# EAGLE design k1fm-pico-balloon-v1.2 (EAGLE 9.2.2)
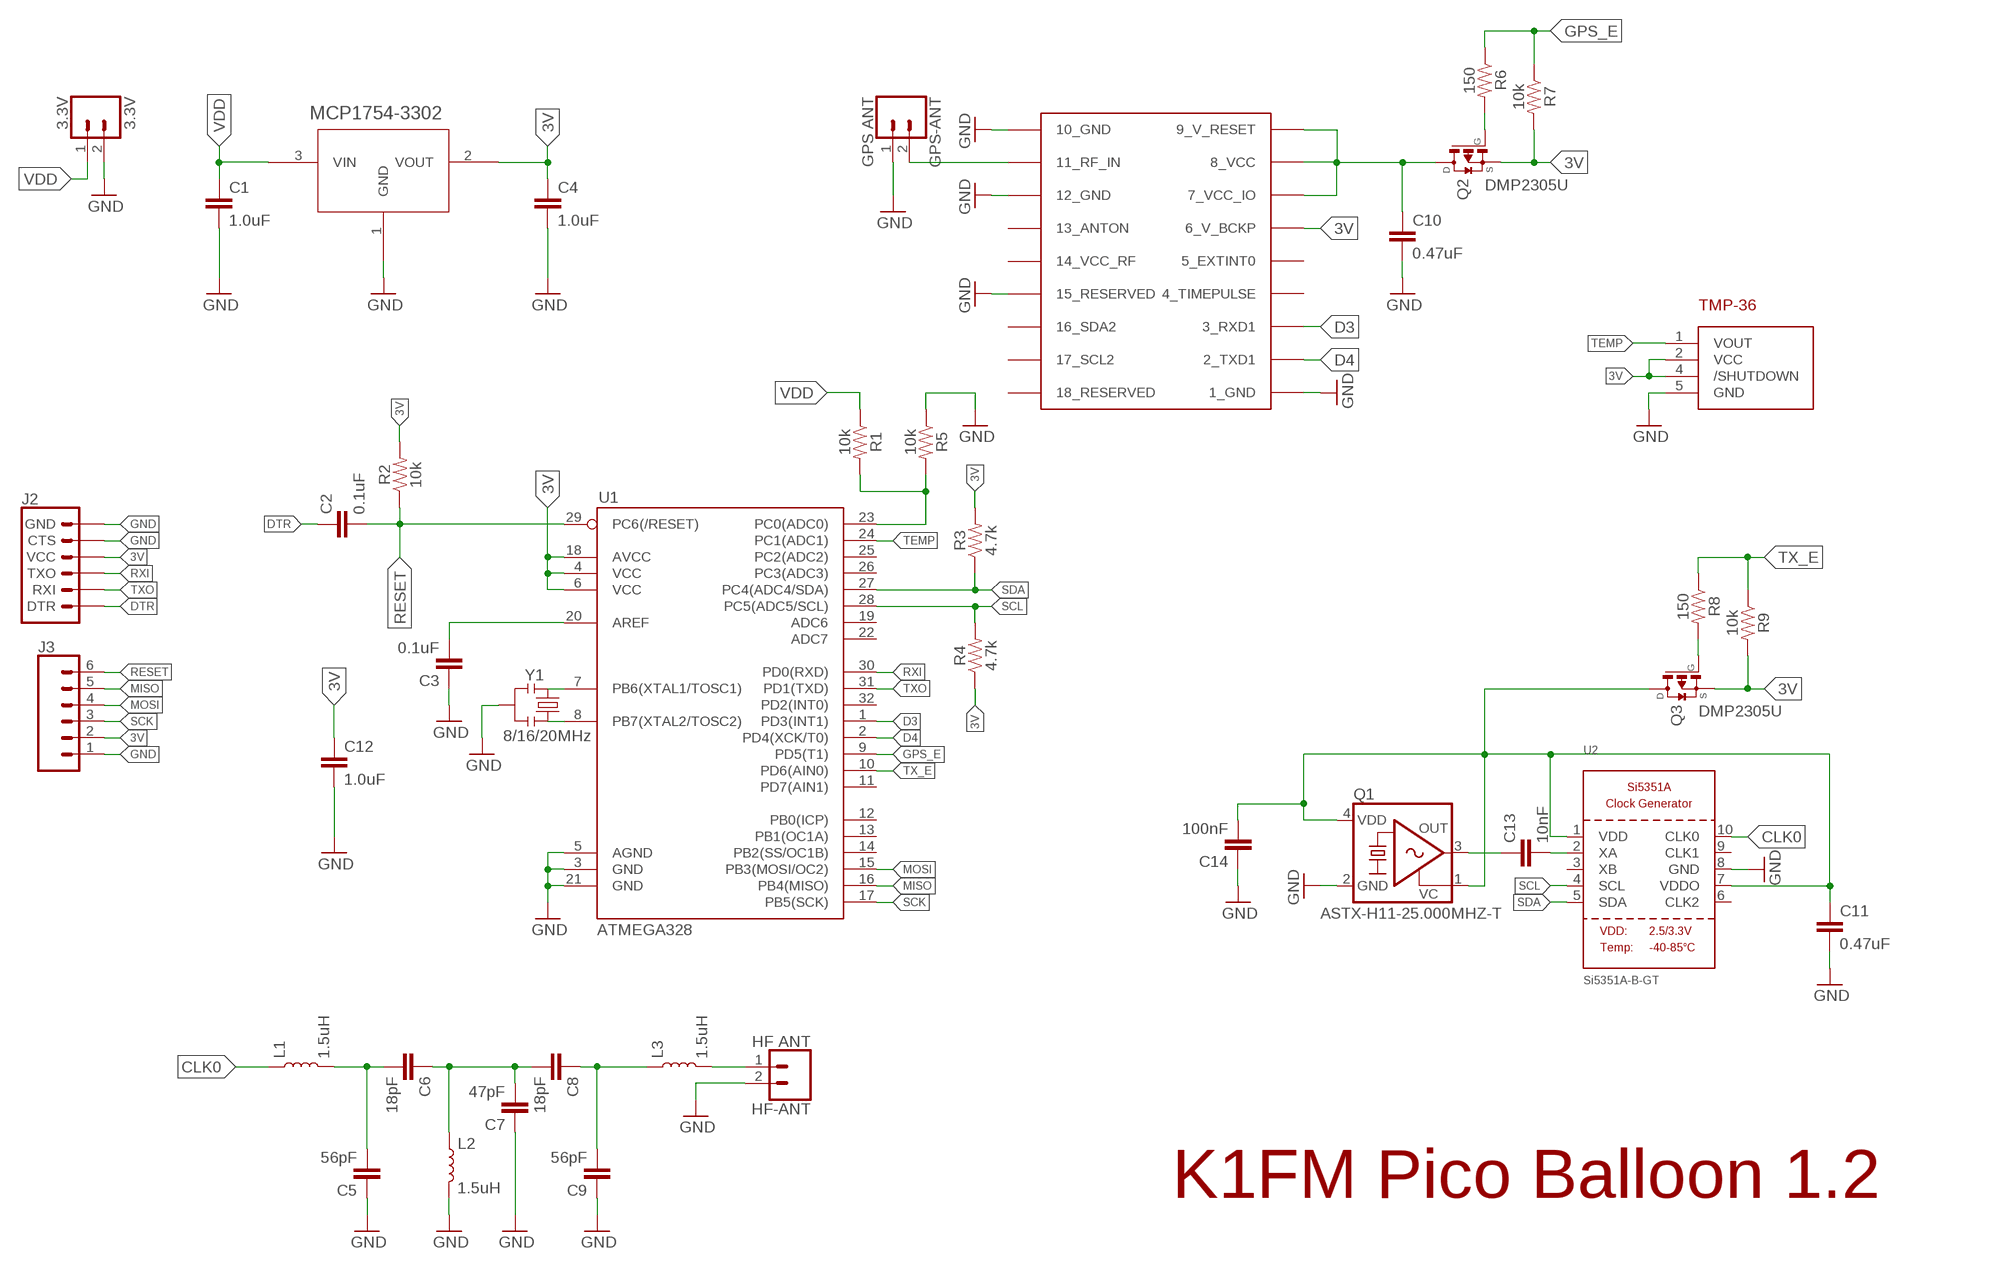
[diagram p0: schematic, sheet 1]

## Parts
3.3V  3.3V  CONN_02  [1X02]
C1  1.0uF  1.0UF-0603-16V-10%  [0603]
C2  0.1uF  0.1UF-0603-25V-5%  [0603]
C3  0.1uF  0.1UF-0603-25V-5%  [0603]
C4  1.0uF  1.0UF-0603-16V-10%  [0603]
C5  56pF  0.1UF-0603-25V-5%  [0603]
C6  18pF  0.1UF-0603-25V-5%  [0603]
C7  47pF  0.1UF-0603-25V-5%  [0603]
C8  18pF  0.1UF-0603-25V-5%  [0603]
C9  56pF  0.1UF-0603-25V-5%  [0603]
C10  0.47uF  0.1UF-0603-25V-5%  [0603]
C11  0.47uF  0.1UF-0603-25V-5%  [0603]
C12  1.0uF  1.0UF-0603-16V-10%  [0603]
C13  10nF  10NF-0603-50V-10%  [0603]
C14  100nF  10NF-0603-50V-10%  [0603]
GPS1  UBLOX_MAX  [UBLOX_MAX]
GPS-ANT  GPS ANT  CONN_02  [1X02]
HF-ANT  HF ANT  CONN_02  [1X02]
J2  6_PIN_SERIAL_TARGET  [1X06]
J3  CONN_06SILK_FEMALE_PTH  [1X06]
L1  1.5uH  INDUCTOR-0603-33NH  [0603]
L2  1.5uH  INDUCTOR-0603-33NH  [0603]
L3  1.5uH  INDUCTOR-0603-33NH  [0603]
Q1  ASTX-H11-25.000MHZ-T  KXO-VCXO-SINE-84  [3.2X2.5_KXO-84]
Q2  DMP2305U  [SOT23]
Q3  DMP2305U  [SOT23]
R1  10k  10KOHM-0603-1/10W-1%  [0603]
R2  10k  10KOHM-0603-1/10W-1%  [0603]
R3  4.7k  4.7KOHM-0603-1/10W-1%  [0603]
R4  4.7k  4.7KOHM-0603-1/10W-1%  [0603]
R5  10k  10KOHM-0603-1/10W-1%  [0603]
R6  150  10KOHM-0603-1/10W-1%  [0603]
R7  10k  10KOHM-0603-1/10W-1%  [0603]
R8  150  10KOHM-0603-1/10W-1%  [0603]
R9  10k  10KOHM-0603-1/10W-1%  [0603]
U1  ATMEGA328  ATMEGA168  [TQFP32-08]
U2  Si5351A-B-GT  SI5351A  [MSOP10]
U3  MCP1754X-XXXXX/C  [SOT-23A_MC]
U4  TMP36  [SOT-23]
Y1  8/16/20MHz  RESONATOR1:1  [RESONATOR-SMD-1:1]

## Nets
3V: C4.1 C12.1 GPS1.6_V_BCKP J2.4(VCC) J3.2 Q2.2(S) Q3.2(S) R2.2 R3.2 R4.1 R7.2 R9.2 U1.4(VCC) U1.6(VCC) U1.18(AVCC) U3.2(VOUT) U4.2(VCC) U4.4(/SHUTDOWN)
ANT: HF-ANT.1 L3.2
AREF: C3.2 U1.20(AREF)
CLK0: L1.1 U2.10(CLK0)
D3: GPS1.3_RXD1 U1.1(PD3(INT1))
D4: GPS1.2_TXD1 U1.2(PD4(XCK/T0))
DTR: C2.1 J2.1(DTR)
GND: 3.3V.2 C1.2 C3.1 C4.2 C5.1 C7.1 C9.1 C10.2 C11.2 C12.2 C14.1 GPS1.1_GND GPS1.10_GND GPS1.12_GND GPS1.15_RESERVED GPS-ANT.1 HF-ANT.2 J2.5(CTS) J2.6(GND) J3.1 L2.2 Q1.2(GND) R5.1 U1.3(GND) U1.5(AGND) U1.21(GND) U2.8(GND) U3.1(GND) U4.5(GND) Y1.2
GPS_E: R6.1 R7.1 U1.9(PD5(T1))
MISO: J3.5 U1.16(PB4(MISO))
MOSI: J3.4 U1.15(PB3(MOSI/OC2))
N$1: C13.1 Q1.3(OUT)
N$2: C13.2 U2.2(XA)
N$4: R1.2 R5.2 U1.23(PC0(ADC0))
N$5: Q2.1(G) R6.2
N$6: GPS1.11_RF_IN GPS-ANT.2
N$7: Q3.1(G) R8.2
N$8: C10.1 GPS1.7_VCC_IO GPS1.8_VCC GPS1.9_V_RESET Q2.3(D)
N$9: C6.1 C7.2 C8.2 L2.1
N$12: C5.2 C6.2 L1.2
N$13: C8.1 C9.2 L3.1
N$15: C11.1 C14.2 Q1.1(VC) Q1.4(VDD) Q3.3(D) U2.1(VDD) U2.7(VDDO)
N$28: U1.8(PB7(XTAL2/TOSC2)) Y1.3
N$29: U1.7(PB6(XTAL1/TOSC1)) Y1.1
RESET: C2.2 J3.6 R2.1 U1.29(PC6(/RESET))
RXI: J2.3(TXO) U1.30(PD0(RXD))
SCK: J3.3 U1.17(PB5(SCK))
SCL: R4.2 U1.28(PC5(ADC5/SCL)) U2.4(SCL)
SDA: R3.1 U1.27(PC4(ADC4/SDA)) U2.5(SDA)
TEMP: U1.24(PC1(ADC1)) U4.1(VOUT)
TX_E: R8.1 R9.1 U1.10(PD6(AIN0))
TXO: J2.2(RXI) U1.31(PD1(TXD))
VDD: 3.3V.1 C1.1 R1.1 U3.3(VIN)
Unconnected: GPS1.4_TIMEPULSE GPS1.5_EXTINT0 GPS1.13_ANTON GPS1.14_VCC_RF GPS1.16_SDA2 GPS1.17_SCL2 GPS1.18_RESERVED U1.11(PD7(AIN1)) U1.12(PB0(ICP)) U1.13(PB1(OC1A)) U1.14(PB2(SS/OC1B)) U1.19(ADC6) U1.22(ADC7) U1.25(PC2(ADC2)) U1.26(PC3(ADC3)) U1.32(PD2(INT0)) U2.3(XB) U2.6(CLK2) U2.9(CLK1)

## Notes on the sheet
- K1FM Pico Balloon 1.2

## Library data of the parts
3.3V GPS-ANT HF-ANT = SparkFun-Connectors:CONN_02: Multi connection point. Often used as Generic Header-pin footprint for 0.1 inch spaced/style header connections On any of the 0.1 inch spaced packages, you can populate with these: Break Away Headers - Straight <https://www.sparkfun.com/products/116> (PRT-00116) Break Away Male Headers - Right Angle <https://www.sparkfun.com/products/553> (PRT-00553) Female Headers <https://www.sparkfun.com/products/115> (PRT-00115) Break Away Headers - Machine Pin <https://www.sparkfun.com/products/117> (PRT-00117) Break Away Female Headers - Swiss Machine Pin <https://www.sparkfun.com/products/743> (PRT-00743) For SCREWTERMINALS and SPRING TERMINALS visit here: Screw Terimnals on SparkFun.com <https://www.sparkfun.com/search/results?term=Screw+Terminals> (5mm/3.5mm/2.54mm spacing) This device is also useful as a general connection point to wire up your design to another part of your project. Our various solder wires solder well into these plated through hole pads. Hook-Up Wire - Assortment (Stranded, 22 AWG) <https://www.sparkfun.com/products/11375> (PRT-11375) Hook-Up Wire - Assortment (Solid Core, 22 AWG) <https://www.sparkfun.com/products/11367> (PRT-11367) View the entire wire category on our website here <https://www.sparkfun.com/categories/141> Special notes: Molex polarized connector foot print use with: PRT-08233 with associated crimp pins and housings. 2.54_SCREWTERM for use with PRT-10571. 3.5mm Screw Terminal footprints for PRT-08084 5mm Screw Terminal footprints for use with PRT-08432
C1 C4 C12 = SparkFun-Capacitors:1.0UF: 1µF ceramic capacitors A capacitor is a passive two-terminal electrical component used to store electrical energy temporarily in an electric field.; PROD_ID: CAP-00868
C2 C3 = SparkFun-Capacitors:0.1UF: 0.1µF ceramic capacitors A capacitor is a passive two-terminal electrical component used to store electrical energy temporarily in an electric field.; PROD_ID: CAP-08604
C5-C11 = SparkFun-Capacitors:0.1UF: 0.1µF ceramic capacitors A capacitor is a passive two-terminal electrical component used to store electrical energy temporarily in an electric field.; PROD_ID: CAP-08604; VALUE: 0.1uF
C13 = SparkFun-Capacitors:10NF: 0.01uF/10nF/10,000pF ceramic capacitors A capacitor is a passive two-terminal electrical component used to store electrical energy temporarily in an electric field. CAP-09321; PROD_ID: CAP-00867
C14 = SparkFun-Capacitors:10NF: 0.01uF/10nF/10,000pF ceramic capacitors A capacitor is a passive two-terminal electrical component used to store electrical energy temporarily in an electric field. CAP-09321; PROD_ID: CAP-00867; VALUE: 10nF
GPS1 = Ava:UBLOX_MAX: UBLOX MAX
J2 = SparkFun-Connectors:6_PIN_SERIAL_TARGET: 6-pin header connection for use with the "FTDI BASIC" pinout - TARGET SIDE. Also known as "Arduino Serial Program Header". It is used to mate with our FTDI Basic serial programmers using the Arduino IDE. Note, this device has "TARGET" in the name. It is intended to be used on a design that contains a target micro-controller that you wish to program. The "sister" device, named "CABLE" is inteneded to be used on a design that usually lives on the end of your USB cable and prvides the converter chip (FTDI232 or FTDI231x) to commnicate serial RX/TX. You can populate with some of these: Break Away Headers - Straight <https://www.sparkfun.com/products/116> (PRT-00116) For reference (or to suit your programming needs) check out these designs: SparkFun FTDI Basic Breakout - 5V <https://www.sparkfun.com/products/9716> (DEV-09716) SparkFun FTDI Basic Breakout - 3.3V <https://www.sparkfun.com/products/9873> (DEV-09873) SparkFun FTDI SmartBasic <https://www.sparkfun.com/products/12935> (DEV-12935) SparkFun Beefy 3 - FTDI Basic Breakout <https://www.sparkfun.com/products/13746> (DEV-13746)
J3 = SparkFun-Connectors:CONN_06: Multi connection point. Often used as Generic Header-pin footprint for 0.1 inch spaced/style header connections On any of the 0.1 inch spaced packages, you can populate with these: Break Away Headers - Straight <https://www.sparkfun.com/products/116> (PRT-00116) Break Away Male Headers - Right Angle <https://www.sparkfun.com/products/553> (PRT-00553) Female Headers <https://www.sparkfun.com/products/115> (PRT-00115) Break Away Headers - Machine Pin <https://www.sparkfun.com/products/117> (PRT-00117) Break Away Female Headers - Swiss Machine Pin <https://www.sparkfun.com/products/743> (PRT-00743) Arduino Stackable Header - 6 Pin <https://www.sparkfun.com/products/9280> (PRT-09280) For SCREWTERMINALS and SPRING TERMINALS visit here: Screw Terimnals on SparkFun.com <https://www.sparkfun.com/search/results?term=Screw+Terminals> (5mm/3.5mm/2.54mm spacing) This device is also useful as a general connection point to wire up your design to another part of your project. Our various solder wires solder well into these plated through hole pads. Hook-Up Wire - Assortment (Stranded, 22 AWG) <https://www.sparkfun.com/products/11375> (PRT-11375) Hook-Up Wire - Assortment (Solid Core, 22 AWG) <https://www.sparkfun.com/products/11367> (PRT-11367) View the entire wire category on our website here <https://www.sparkfun.com/categories/141>; PROD_ID: CONN-08437
L1-L3 = SparkFun-Coils:INDUCTOR: Inductors Resist changes in electrical current. Basically a coil of wire. SparkFun Products: SparkFun Load Cell Amplifier - HX711 <https://www.sparkfun.com/products/13879> IOIO-OTG - V2.2 <https://www.sparkfun.com/products/13613>; PROD_ID: NDUC-07874; VALUE: 33nH/±5%/500mA
Q1 = crystal-geyer_V1_0:KXO-VCXO-SINE: VCXO : Sinewave - Serie Model Size l/w/h [mm] Frequency Range Frequency Stability Temp. Range [°C] Output AECQ 200 availabel Datasheet KXO-81 KXO-86 KXO-84 KXO-83 KXO-82 2.0/1.6/0.7 2.5/2.0/0.7 3.2/2.5/1.0 5.0/3.2/1.5 7.0/5.0/2.0 13,0 ~ 40,0 MHz 13,0 ~ 40,0 MHz 10,0 ~ 26,0 MHz 12,0 ~ 26,0 MHz 12,6 ~ 20,0 MHz ±10 … ±50ppm ±10 … ±50ppm ±10 … ±50ppm ±10 … ±50ppm ±10 … ±50ppm (*) -30°C …+75°C (*) -30°C …+75°C (*) -40°C …+85°C (*) -40°C …+85°C (*) -30°C …+80°C Sinewave Sinewave Sinewave Sinewave Sinewave - - - - - KXO-81.pdf <http://www.geyer-electronic.de/uploads/tx_userartikelfrequenz/GEYER-KXO-81-VCXO-sinewave.pdf> KXO-86.pdf <http://www.geyer-electronic.de/uploads/tx_userartikelfrequenz/GEYER-KXO-86-VCXO-sinewave.pdf> KXO-84.pdf <http://www.geyer-electronic.de/uploads/tx_userartikelfrequenz/GEYER-KXO-84-VCXO-sinewave.pdf> KXO-83.pdf <http://www.geyer-electronic.de/uploads/tx_userartikelfrequenz/GEYER-KXO-83-VCXO-sinewave.pdf> KXO-82.pdf <http://www.geyer-electronic.de/uploads/tx_userartikelfrequenz/GEYER-KXO-82-VCXO-sinewave.pdf> <http://www.geyer-electronic.de/fileadmin/template/img/logo-geyer-electronic.png> Details see: http://www.geyer-electronic.de/Frequenz-Produkte.9.0.html Created 2016-06-07, Hans Locher 2016 (C) Geyer Quartz Technology KXO81,KXO86,KXO84,KXO83,KXO82,2,0x1,6;2.0x1.6;2,5x2,0;2.5x2.0;3,2x2,5;3.2x2.5;5,0x3,2;5.0x3.2;7,0x5,0;7.0x5.0;2016;2520;3225;5032;7050
Q2 Q3 = transistor-fet:DMP2305U: P-Channel Enhancement MOSFET
R1 R2 R5 R7 R9 = SparkFun-Resistors:10KOHM: 10kΩ resistor A resistor is a passive two-terminal electrical component that implements electrical resistance as a circuit element. Resistors act to reduce current flow, and, at the same time, act to lower voltage levels within circuits. - Wikipedia; PROD_ID: RES-00824
R3 R4 = SparkFun-Resistors:4.7KOHM: 4.7kΩ resistor A resistor is a passive two-terminal electrical component that implements electrical resistance as a circuit element. Resistors act to reduce current flow, and, at the same time, act to lower voltage levels within circuits. - Wikipedia; PROD_ID: RES-07857
R6 R8 = SparkFun-Resistors:10KOHM: 10kΩ resistor A resistor is a passive two-terminal electrical component that implements electrical resistance as a circuit element. Resistors act to reduce current flow, and, at the same time, act to lower voltage levels within circuits. - Wikipedia; PROD_ID: RES-00824; VALUE: 10k
U1 = SparkFun:ATMEGA168
U2 = microbuilder:SI5351A: Si5351A 8kHz-160MHz I2C Clock Generator VDD: 2.5V or 3.3V Input Range: 25MHz or 27MHz XTAL User selectable internal input load capacitors: 6, 8 or 10 pF Output Impedance: 85 Ohm Output Load Capacitance: 5-15pF Operating Temperature: -40°C - 85°C Operating Current (3 outputs): 35mA Output buffer voltage (VDDO): 1.8, 2.5 or 3.3V Note: If VDDO is not used it should be connected to VDD. Unused clock out pins should be left floating.
U3 = MCP1754:MCP1754X-XXXXX/C
U4 = TMP36:TMP36
Y1 = Testing:RESONATOR: Resonator Small SMD resonator. This is the itty bitty 10/20MHz resonators with built in caps. CSTCE10M0G55 and CSTCE20M0V53. Footprint for SMD has been used in SFE production for years, and does work okay. 1:1 is an attempt to get larger fillets on the sides so it will be easier to inspect these solders in our AOI machine. The pads have been minimized to match the actual metal under the resonator. To see this relation, it includes an image import of the bottom side of the component. Imported to scale on layer 200.

## Net classes
1 vcc: width 0.254 mm

## Board
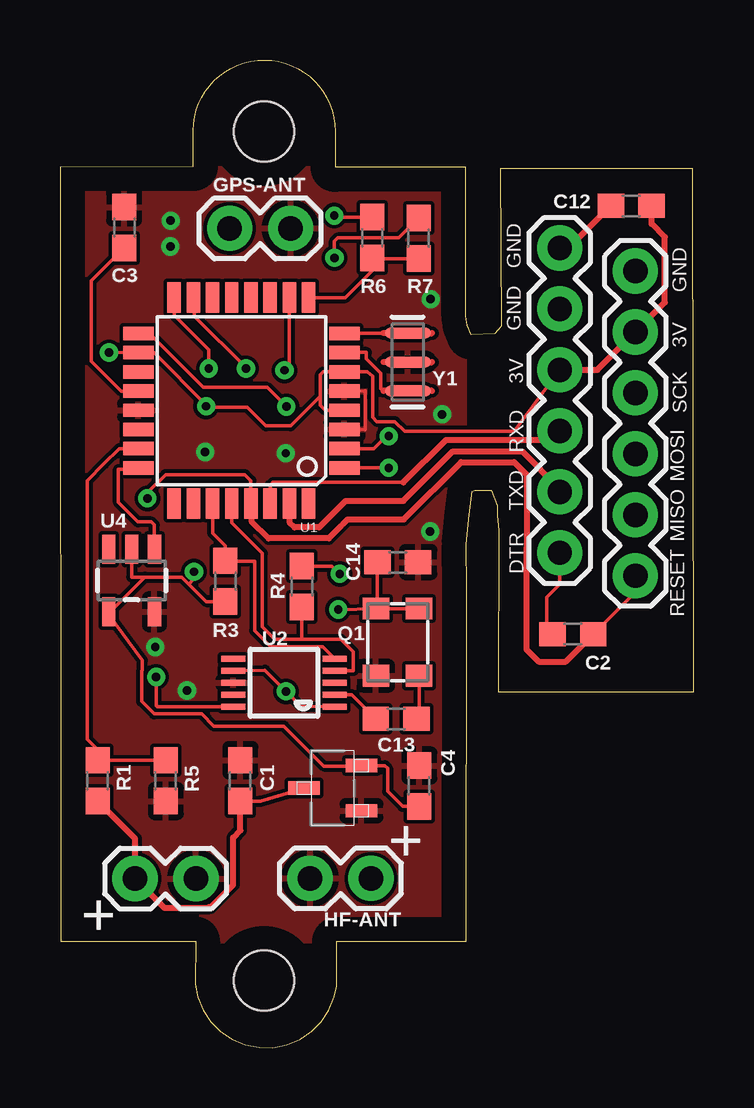
[diagram p1: board, top side]
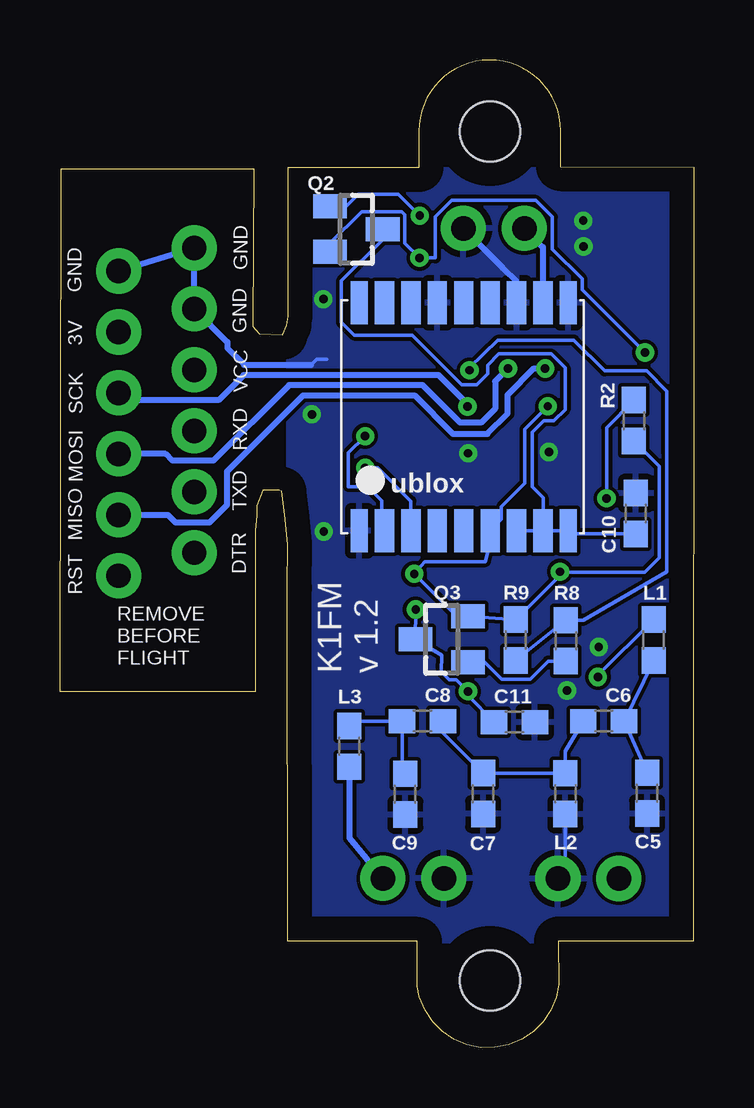
[diagram p2: board, bottom side, seen from below]

Size 26.41 x 41.15 mm. Coordinates in mm from the lower left corner, seen from the top.
Outline: 0.02,4.43 5.65,4.44 5.64,2.62 5.75,2.1 5.97,1.56 6.29,1.08 6.71,0.66 7.18,0.34 7.72,0.12 8.3,0 8.87,0 9.46,0.12 10,0.34 10.49,0.67 10.88,1.06 11.21,1.55 11.44,2.11 11.53,2.56 11.53,4.42 16.93,4.43 16.94,19.15 16.93,20.95 17.03,22 17.08,22.37 17.17,23.17 17.29,23.22 17.96,23.23 18.22,22.58 18.22,22.46 18.22,22.18 18.28,21.54 18.29,21.52 18.27,14.81 26.41,14.82 26.37,36.62 18.35,36.61 18.38,30.05 18.12,29.73 17.13,29.7 16.96,30.1 16.91,30.48 16.91,36.67 11.46,36.67 11.46,38.17 arc180 5.55,38.21 5.55,36.71 0,36.67 0.02,4.43
Copper layers (1*16): Top 0.035mm / dielectric 0.15mm / Bottom 0.035mm
Design rules "default": minimum track width 6mil, minimum drill 0.35mm, track to track 6mil, track to pad 6mil, pad to pad 6mil, via to via 6mil, smd to smd 6mil, copper to edge 40mil, drill to drill 6mil, minimum pad ring 10mil, minimum via ring 8mil, stop-mask expansion 4mil, vias tented up to drill 0mil, thermal gap 10mil
Holes 2.5 mm at 8.5,38.17 8.5,2.79

### Footprints (pad centres in the part's own frame; a part is rotated, then mirrored left to right if it is on the bottom)
1X02 = drill 1.016 pad 1.88: 1 0,0; 2 2.54,0
0603 = smd 1.1 x 1: 1 -0.85,0; 2 0.85,0
UBLOX_MAX = smd 1.8 x 0.7: 1_GND 4.95,-4.4; 9_V_RESET 4.95,4.3; 10_GND -4.55,4.3; 18_RESERVED -4.55,-4.4 | smd 1.8 x 0.8: 2_TXD1 4.95,-3.35; 3_RXD1 4.95,-2.25; 4_TIMEPULSE 4.95,-1.15; 5_EXTINT0 4.95,-0.05; 6_V_BCKP 4.95,1.05; 7_VCC_IO 4.95,2.15; 8_VCC 4.95,3.25; 11_RF_IN -4.55,3.25; 12_GND -4.55,2.15; 13_ANTON -4.55,1.05; 14_VCC_RF -4.55,-0.05; 15_RESERVED -4.55,-1.15; 16_SDA2 -4.55,-2.25; 17_SCL2 -4.55,-3.35
1X06 = drill 1.016 pad 1.88: 1 0,0; 2 2.54,0; 3 5.08,0; 4 7.62,0; 5 10.16,0; 6 12.7,0
3.2X2.5_KXO-84 = smd 0.9 x 1.1: 1 -1.4,-0.9; 2 1.4,-0.9; 3 1.4,0.9; 4 -1.4,0.9
SOT23 = smd 1 x 1.4: 1 -0.95,-1.1; 2 0.95,-1.1; 3 0,1.1
TQFP32-08 = smd 1.27 x 0.559: 1 -4.293,2.8; 2 -4.293,2; 3 -4.293,1.2; 4 -4.293,0.4; 5 -4.293,-0.4; 6 -4.293,-1.2; 7 -4.293,-2; 8 -4.293,-2.8; 17 4.293,-2.8; 18 4.293,-2; 19 4.293,-1.2; 20 4.293,-0.4; 21 4.293,0.4; 22 4.293,1.2; 23 4.293,2; 24 4.293,2.8 | smd 0.559 x 1.27: 9 -2.8,-4.293; 10 -2,-4.293; 11 -1.2,-4.293; 12 -0.4,-4.293; 13 0.4,-4.293; 14 1.2,-4.293; 15 2,-4.293; 16 2.8,-4.293; 25 2.8,4.293; 26 2,4.293; 27 1.2,4.293; 28 0.4,4.293; 29 -0.4,4.293; 30 -1.2,4.293; 31 -2,4.293; 32 -2.8,4.293
MSOP10 = smd 0.25 x 1: 1 -1,-2.113; 2 -0.5,-2.113; 3 0,-2.113; 4 0.5,-2.113; 5 1,-2.113; 6 1,2.113; 7 0.5,2.113; 8 0,2.113; 9 -0.5,2.113; 10 -1,2.113
SOT-23A_MC = smd 0.559 x 1.321: 1 -0.94,-1.194; 2 0.94,-1.194; 3 0,1.194
SOT-23 = smd 0.55 x 1.2: 1 -0.95,-1.3; 2 0,-1.3; 3 0.95,-1.3; 4 0.95,1.3; 5 -0.95,1.3
RESONATOR-SMD-1:1 = smd 0.45 x 1.905: 1 -1.2,0; 2 0,0; 3 1.2,0

### Placement (x,y rotation side)
3.3V  3.13,7.04 0 top
C1  7.51,11.12 90 top
C2  21.37,17.22 0 top
C3  2.67,34.17 270 top
C4  14.97,10.9 90 top
C5  1.95,10.6 90 bottom
C6  3.76,13.59 0 bottom
C7  8.78,10.58 90 bottom
C8  11.31,13.59 0 bottom
C9  12.03,10.56 90 bottom
C10  2.42,22.25 90 bottom
C11  7.48,13.56 0 bottom
C12  23.8,35.07 180 top
C13  14,13.7 180 top
C14  14.07,20.22 180 top
GPS1  9.54,26.48 270 bottom
GPS-ANT  9.61,34.13 180 top
HF-ANT  12.96,7.05 180 top
J2  20.82,20.61 90 top
J3  23.97,32.35 270 top
L1  1.68,16.98 270 bottom
L2  5.36,10.58 270 bottom
L3  14.37,12.55 270 bottom
Q1  14.06,16.89 270 top
Q2  14.07,34.1 270 bottom
Q3  10.51,17.01 90 bottom
R1  1.56,11.12 90 top
R2  2.5,26.12 270 bottom
R3  6.89,19.43 270 top
R4  10.08,19.21 270 top
R5  4.41,11.12 90 top
R6  13.02,33.75 90 top
R7  14.95,33.72 90 top
R8  5.34,16.95 270 bottom
R9  7.42,16.98 90 bottom
U1  7.56,26.95 180 top
U2  9.33,15.2 90 top
U3  11.37,10.81 90 top
U4  2.99,19.46 180 top
Y1  14.49,28.56 90 top

### Tracks (layer width: path | path; a pad name or v marks a point on that pad's centre or on a via)
3V  (via drill 0.35)
  Top 0.152: 10.85,27.14 10.85,26.75 11.05,26.55 U1.4 | 10.85,27.14 10.85,28.04 10.96,28.15 U1.6 12.8,28.15 13.04,27.97 13.04,26.25 13.21,26.08 13.95,26.08 14.36,25.67 18.92,25.67 J2.4 | 10.85,27.14 9.61,25.91 8.58,25.91 7.81,26.67 6.13,26.67 v6.09,26.72 6.12,26.75 3.92,28.95 U1.18 v2.04,28.96 | 3.54,19.6 2.1,18.16 U4.4 2.04,18.03 3.44,16.13 3.44,15.73 3.4,15.69 3.4,14.42 3.92,13.9 5.9,13.9 6.41,13.39 9.32,13.39 arc90 9.32,13.39 10.99,11.72 12.54,11.72 U3.2 13.53,11.75 13.65,11.63 13.65,10.68 14.28,10.05 C4.1 | U4.2 | U4.2 2.99,19.6 3.54,19.6 | 3.54,19.6 5.07,19.6 5.36,19.31 | R3.2 6.08,18.58 5.36,19.31 | v5.58,19.83 5.58,19.53 5.36,19.31 | R7.2 14.11,33.73 11.56,33.73 11.44,33.6 v11.44,32.9 | R4.1 11.33,20.06 v11.66,19.73
  Top 0.254: J2.4 22.39,28.23 J3.2 25.2,31.05 25.2,33.77 24.65,34.32 C12.1
  Bottom 0.152: v6.09,26.72 7.04,25.77 7.04,23.51 8.02,22.53 8.02,22.01 GPS1.6_V_BCKP 8.38,21.42 8.69,20.25 11.21,20.25 v11.66,19.73 9.88,17.96 Q3.2 R9.2 5.58,19.67 5.58,19.81 | v2.04,28.96 4.66,31.58 4.66,32.03 5.9,33.27 5.9,34.61 6.58,35.3 10.09,35.3 10.78,34.61 10.78,32.9 v11.44,32.9 12.04,33.51 12.04,34.69 12.17,34.83 13.85,34.83 15.17,33.5 Q2.2 | 5.58,19.81 v5.58,19.83 | R2.2 1.45,24.22 1.45,20.4 2.04,19.81 5.58,19.81
ANT
  Bottom 0.254: L3.2 14.35,11.68 14.35,8.72 HF-ANT.1
AREF
  Top 0.152: U1.20 2.54,27.35 1.3,28.59 1.3,31.95 C3.2
CLK0  (via drill 0.35)
  Top 0.152: U2.10 4.05,14.2 4,14.25 v4,15.44
  Bottom 0.152: v4,15.44 4,15.51 L1.1
D3  (via drill 0.35)
  Top 0.152: v13.7,24.15 U1.1
  Bottom 0.152: GPS1.3_RXD1 11.79,22.76 13.18,24.15 v13.7,24.15
D4  (via drill 0.35)
  Top 0.152: U1.2 13.08,24.95 13.6,25.47 v13.7,25.47
  Bottom 0.152: GPS1.2_TXD1 13,21.64 13,22.77 13.6,23.37 14.4,23.37 14.4,24.77 v13.7,25.47
DTR
  Top 0.152: J2.1 20.82,19.31 20.29,18.77 20.29,17.45 C2.1
GND  (via drill 0.35)
  Top 0.152: 13.83,28.56 Y1.2 13.71,28.59 | U1.5 12.72,27.36 12.72,25.74 U1.3
  Top 0.254: C12.2 21.2,33.31 J2.6
  Bottom 0.152: 15.3,28.67 15.71,28.67 15.95,28.44 | L2.2 5.36,7.35 3.3V.2
  Bottom 0.25: J2.5 19.44,29.39 19.44,29.14 18.74,28.44 15.95,28.44
  Bottom 0.254: GPS-ANT.1 7.97,32.49 7.97,32.47 7.39,31.9 GPS1.12_GND | J2.5 J2.6 J3.1
  other vias: 4.6,33.37 6.05,24.81 15.44,31.18 4.61,34.45 15.92,26.38 15.42,21.5 5.29,14.87 3.97,16.69 9.41,24.76
  pour Top: 0,36.65 16.89,36.65 16.89,36.65 16.89,4.43 16.93,4.47 16.93,4.41 0.04,4.41 0.02,4.43
  pour Bottom: -0.02,36.62 16.93,36.62 16.93,4.42 16.94,4.41 0.05,4.41 0,4.46
GPS_E
  Top 0.152: U1.9 11.89,31.25 13.02,32.37 R6.1 13.04,32.87 R7.1
MISO  (via drill 0.35)
  Top 0.152: v6.2,28.29 6.2,29.08 4.76,30.52 U1.16
  Bottom 0.254: J3.5 21.91,22.19 21.61,21.89 20.18,21.89 19.45,22.61 19.45,24 16.29,27.17 11.64,27.17 10.04,25.57 8.61,25.57 7.77,26.41 7.77,27.19 6.67,28.29 v6.2,28.29
MOSI  (via drill 0.35)
  Top 0.152: v7.75,28.29 7.75,28.32 5.6,30.47 5.6,31.2 U1.15
  Bottom 0.254: J3.4 22.02,24.73 21.73,24.45 20.02,24.45 16.87,27.6 11.31,27.6 9.74,26.03 8.86,26.03 8.28,26.61 8.28,27.76 v7.75,28.29
N$1
  Top 0.152: Q1.3 14.96,15.37 14.96,15.2 14.96,13.8 arc-90 C13.1
N$2
  Top 0.152: U2.2 12.15,14.7 C13.2
N$4
  Top 0.152: U1.23 2.47,24.95 1.83,24.32 1.83,24.31 1.13,23.61 1.13,12.84 1.56,12.41 R1.2 R5.2
N$5  (via drill 0.35)
  Top 0.152: v11.43,34.66 11.49,34.6 R6.2
  Bottom 0.152: Q2.1 14.49,35.05 13.98,35.56 12.33,35.56 v11.43,34.66
N$6
  Bottom 0.254: GPS-ANT.2 6.29,33.35 GPS1.11_RF_IN
N$7
  Bottom 0.152: R8.2 6.08,16.1 6.83,15.35 8.02,15.35 8.72,16.06 Q3.1
N$8
  Bottom 0.152: GPS1.7_VCC_IO GPS1.8_VCC | GPS1.8_VCC 5.3,21.53 | 5.3,21.53 GPS1.9_V_RESET | Q2.3 12.97,33.67 14.69,31.94 14.69,30.21 14.16,29.68 11.75,29.68 9.67,27.61 9.05,27.61 8.59,28.07 8.59,28.43 8.13,28.9 5.95,28.9 5.37,28.32 5.37,26.58 5.84,26.11 6.27,26.11 6.74,25.64 6.74,23.36 6.29,22.91 GPS1.8_VCC | C10.1 5.17,21.4 5.3,21.53
N$9
  Bottom 0.152: C6.1 5.36,12.34 L2.1 C7.2 10.46,13.11 C8.2
N$12
  Bottom 0.152: L1.2 1.7,16.08 C6.2 C5.2
N$13
  Bottom 0.152: C9.2 12.16,11.54 C8.1 14.18,13.59 L3.1
N$15  (via drill 0.35)
  Top 0.152: U2.7 8.54,15.72 9.24,15.01 v9.42,14.84 10.03,14.22 U2.1 | Q1.4 Q1.1 | Q1.1 v11.59,18.25 11.57,18.22 | Q1.1 13.22,18.35 C14.2
  Bottom 0.152: v11.59,18.25 Q3.3 10.52,16.34 10.53,15.66 10.21,15.33 9.91,15.33 v9.42,14.84 9.42,14.68 C11.1
N$28
  Top 0.152: U1.8 Y1.3
N$29
  Top 0.152: Y1.1 13.46,27.35 13.36,27.45 13.36,28.1 12.76,28.69 12.76,28.96 U1.7
RESET  (via drill 0.35)
  Top 0.152: C2.2 23.97,18.97 J3.6 | 7.98,22.64 U1.29 7.96,23.61 7.7,23.87 4.4,23.87 3.64,23.11 v3.64,22.88 | 11.79,21.81 11.71,21.73 | 19.44,20.81 19.44,20.8
  Top 0.254: C2.2 21.08,16.08 19.94,16.08 19.44,16.58 19.44,20.8 | 7.98,22.64 7.98,21.93 8.7,21.22 11.2,21.22 11.71,21.73 | 11.79,21.81 11.98,22.01 14.33,22.01 16.71,24.39 18.92,24.39 19.44,23.86 19.44,20.81
  Bottom 0.152: R2.1 3.64,25.83 v3.64,22.88
RXI
  Top 0.152: U1.30 8.76,23.43 8.87,23.55 14.31,23.55
  Top 0.254: J2.3 20.44,25.31 16.07,25.31 14.31,23.55
SCK  (via drill 0.35)
  Top 0.152: U1.17 3.72,29.75 5.33,28.15 5.97,27.51 8.63,27.51 v9.43,26.71
  Bottom 0.152: v9.43,26.71 9.38,26.76
  Bottom 0.25: 9.38,26.76 10.64,28.01 18.76,28.01 19.8,26.97 23.67,26.97 J3.3
SCL
  Top 0.152: U2.4 12.21,15.7 12.22,15.72 12.22,16.49 11.7,17.02 10.11,17.02 | 10.11,17.02 8.94,17.02 8.43,17.52 8.43,20.59 7.16,21.86 U1.28 | R4.2 10.08,17.05 10.11,17.02
SDA
  Top 0.152: U1.27 6.36,21.44 6.89,20.9 R3.1 6.91,20.27 8.11,20.27 8.11,17.37 8.79,16.7 10.95,16.7 U2.5
TEMP
  Top 0.152: U4.1 3.94,21.77 3.81,21.91 3.25,21.91 2.44,22.71 2.44,24.09 3.2,24.09 U1.24
TX_E  (via drill 0.35)
  Top 0.152: U1.10 9.56,28.24 9.36,28.22 v9.35,28.22
  Bottom 0.152: R9.1 R8.1 4.62,17.8 1.13,19.82 1.14,24.79 | 1.14,24.79 | v9.35,28.22 9.35,28.33 8.18,29.47 5.01,29.47 3.72,28.19 1.97,28.19 1.14,27.35 1.14,24.79
TXO
  Top 0.254: U1.31 9.56,21.89 9.78,21.67 10.8,21.67 11.9,22.78 14.3,22.78 16.37,24.84 19.25,24.84 20.82,23.27 J2.2
VDD
  Top 0.152: C1.1 8.34,10.27 U3.3
  Top 0.254: R1.1 3.13,8.71 3.3V.1 4.35,5.82 6.17,5.82 6.2,5.85 6.29,5.85 7.21,6.78 7.21,8.75 7.51,9.04 C1.1

### Text on the board
tPlace: GND | GND | GND | 3V | 3V | SCK | RXD | MOSI | MISO | TXD | DTR | RESET
tNames: + | +
bNames: GND | GND | 3V | GND | VCC | SCK | MOSI | RXD | MISO | TXD | RST | DTR | K1FM / v 1.2 | REMOVE / BEFORE / FLIGHT